# Altium project SINUX_F1.PrjPcb
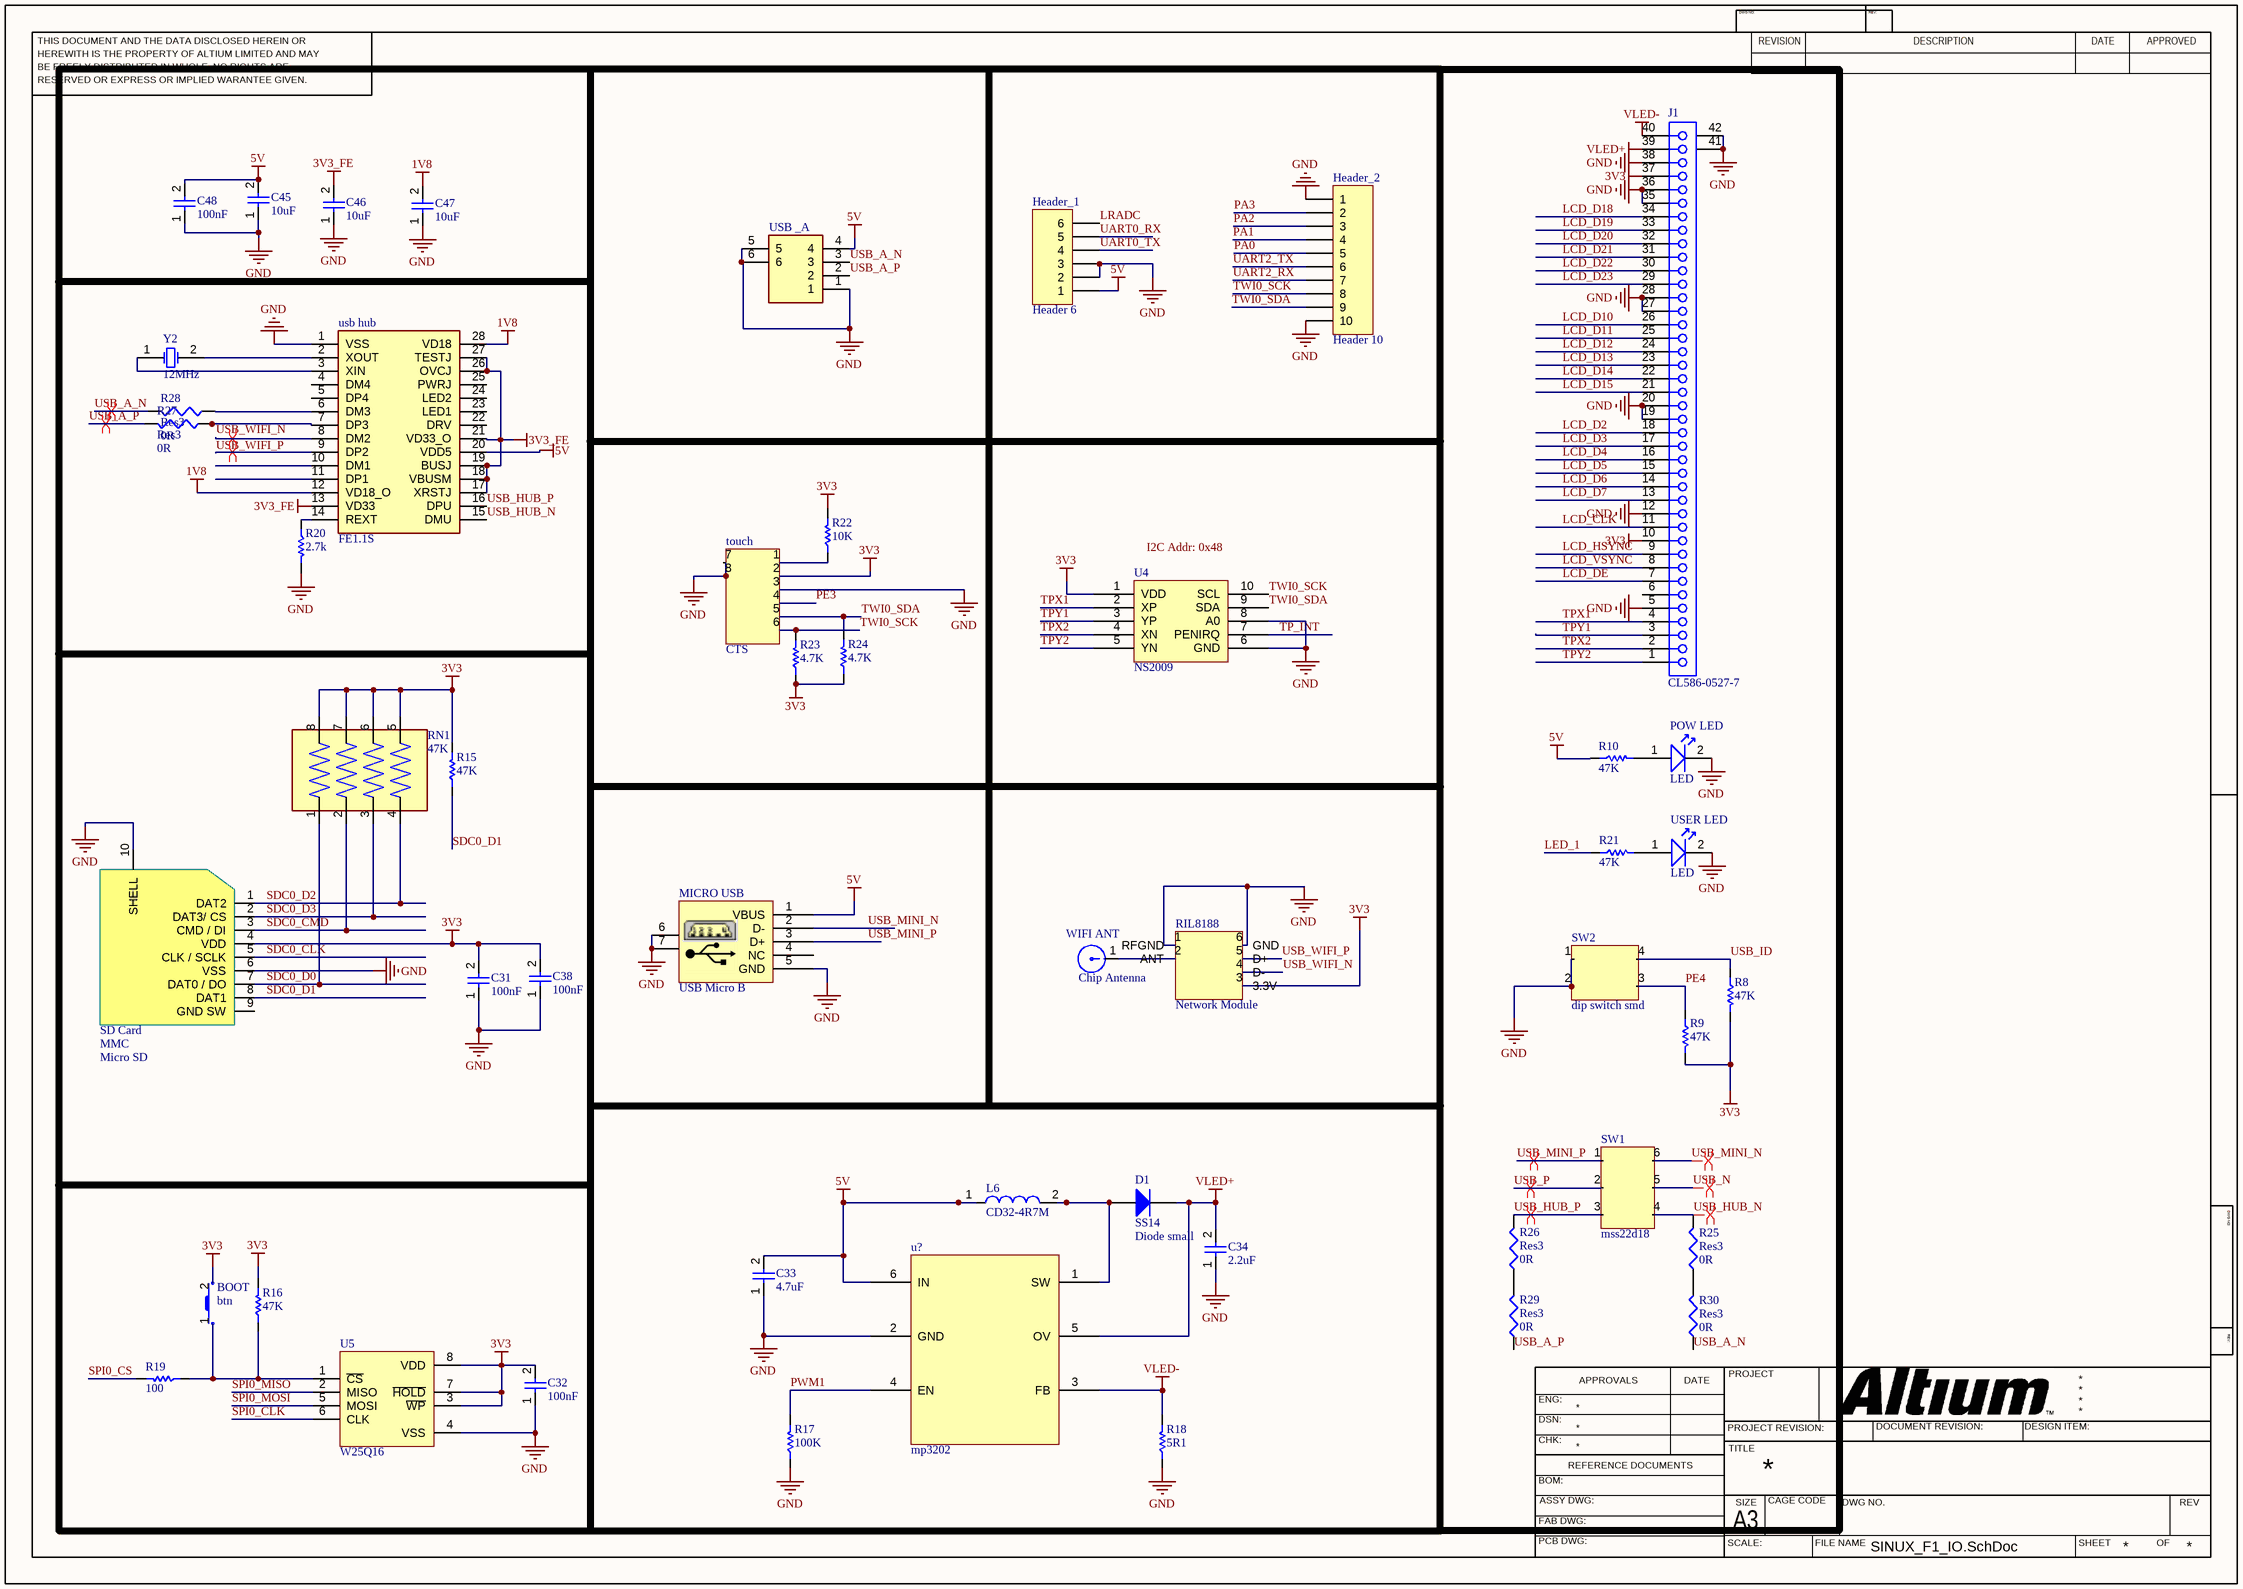
[diagram p0: SINUX_F1_IO.SchDoc]
3 sheets, 107 parts. Net scope: global (net labels, ports and power ports of the same name join across sheets).
Board file: SINUX_F1.PcbDoc
Sheets:
  SINUX_F1_IO.SchDoc
  SINUX_F1_MAIN.SchDoc
  SINUX_F1_POWER.SchDoc

## Sheet SINUX_F1_IO.SchDoc
size 420 x 297 mm

### Parts
BOOT  btn  [btn]
C31  100nF  [SMD 0805]
C32  100nF  [SMD 0805]
C33  4.7uF  [SMD 0805]
C34  2.2uF  [SMD 0805]
C38  100nF  [SMD 0805]
C45  10uF  [SMD 0805]
C46  10uF  [SMD 0805]
C47  10uF  [SMD 0805]
C48  100nF  [SMD 0805]
D1  SS14  [Diode small SMD]
Header_1  Header 6  [HDR1X6]
Header_2  Header 10  [HDR1X10]
J1  CL586-0527-7  [FH12-40S-0.5SH]
L6  CD32-4R7M  [CD324R7M]
MICRO_USB  USB Micro B  [USB mini]
POW_LED  LED  [0805 LED]
R8  47K  [0805_1/8W]
R9  47K  [0805_1/8W]
R10  47K  [0805_1/8W]
R15  47K  [0805_1/8W]
R16  47K  [0805_1/8W]
R17  100K  [0805_1/8W]
R18  5R1  [0805_1/8W]
R19  100  [0805_1/8W]
R20  2.7k  [0805_1/8W]
R21  47K  [0805_1/8W]
R22  10K  [0805_1/8W]
R23  4.7K  [0805_1/8W]
R24  4.7K  [0805_1/8W]
R25  Res3  value 0R  [J1-0603]
R26  Res3  value 0R  [J1-0603]
R27  Res3  value 0R  [J1-0603]
R28  Res3  value 0R  [J1-0603]
R29  Res3  value 0R  [J1-0603]
R30  Res3  value 0R  [J1-0603]
RIL8188  Network Module  [ril8188]
RN1  47K  [RESCAF80P320X160X60-8N]
SD_Card  MMC  [MICRO SD]
SW1  mss22d18  [MSS22D18]
SW2  dip switch smd  [DIP SWITCH SMD]
touch  CTS  [TS]
U4  NS2009  [SOP50P490X110-11N]
U5  W25Q16  [SOIC 8-Lead  (5.08mm)]
u?  mp3202  [SOP95P275X110-6N]
USB__A  (no value)  [614104150121]
usb_hub  FE1.1S  [SOP64P600X175-28N]
USER_LED  LED  [0805 LED]
WIFI_ANT  Chip Antenna  [2.4GHz Antenna]
Y2  12MHz  [XTAL  SMD]

### Nets
1V8: C47.2 usb_hub.12(VD18_O) usb_hub.28(VD18)
3V3: BOOT.2 C31.2 C32.2 C38.2 J1.10 J1.37 R8.2 R9.2 R15.2 R16.2 R22.2 R23.1 R24.1 RIL8188.3(3.3V) RN1.5 RN1.6 RN1.7 RN1.8 SD_Card.4(VDD) touch.2 U4.1(VDD) U5.3(~{WP}) U5.7(~{HOLD}) U5.8(VDD)
3V3_FE: C46.2 usb_hub.13(VD33) usb_hub.17(XRSTJ) usb_hub.18(VBUSM) usb_hub.19(BUSJ) usb_hub.21(VD33_O) usb_hub.26(OVCJ) usb_hub.27(TESTJ)
5V: C33.2 C45.2 C48.2 Header_1.1 L6.1 MICRO_USB.1(VBUS) R10.1 u?.6(IN) USB__A.4 usb_hub.20(VDD5)
GND: C31.1 C32.1 C33.1 C34.1 C38.1 C45.1 C46.1 C47.1 C48.1 Header_1.2 Header_1.3 Header_2.1 Header_2.10 J1.5 J1.12 J1.19 J1.20 J1.27 J1.28 J1.35 J1.36 J1.38 J1.41(MH1) J1.42(MH2) MICRO_USB.5(GND) MICRO_USB.6 MICRO_USB.7 POW_LED.2 R17.1 R18.1 R20.2 RIL8188.1(RFGND) RIL8188.6(GND) SD_Card.6(VSS) SD_Card.10(SHELL) SW2.1 SW2.2 touch.3 touch.7 touch.8 U4.6(GND) U4.8(A0) U5.4(VSS) u?.2(GND) USB__A.1 USB__A.5 USB__A.6 usb_hub.1(VSS) USER_LED.2
VLED+: C34.2 D1.2(K) J1.39 u?.5(OV)
VLED-: J1.40 R18.2 u?.3(FB)
LCD_CLK: J1.11
LCD_D2: J1.18
LCD_D3: J1.17
LCD_D4: J1.16
LCD_D5: J1.15
LCD_D6: J1.14
LCD_D7: J1.13
LCD_D10: J1.26
LCD_D11: J1.25
LCD_D12: J1.24
LCD_D13: J1.23
LCD_D14: J1.22
LCD_D15: J1.21
LCD_D18: J1.34
LCD_D19: J1.33
LCD_D20: J1.32
LCD_D21: J1.31
LCD_D22: J1.30
LCD_D23: J1.29
LCD_DE: J1.7
LCD_HSYNC: J1.9
LCD_VSYNC: J1.8
LED_1: R21.1
LRADC: Header_1.6
PA0: Header_2.5
PA1: Header_2.4
PA2: Header_2.3
PA3: Header_2.2
PE3: touch.4  [project net CSI_D0]
PE4: R9.1 SW2.3  [project net CSI_D1]
PWM1: R17.2 u?.4(EN)  [project net CSI_D3]
SDC0_CLK: SD_Card.5(CLK_/_SCLK)
SDC0_CMD: RN1.2 SD_Card.3(CMD_/_DI)
SDC0_D0: RN1.1 SD_Card.7(DAT0_/_DO)
SDC0_D1: R15.1 SD_Card.8(DAT1)
SDC0_D2: RN1.4 SD_Card.1(DAT2)
SDC0_D3: RN1.3 SD_Card.2(DAT3/_CS)
SPI0_CLK: U5.6(CLK)
SPI0_CS: R19.2
SPI0_MISO: U5.2(MISO)
SPI0_MOSI: U5.5(MOSI)
TP_INT: U4.7(PENIRQ)
TPX1: J1.4 U4.2(XP)
TPX2: J1.2 U4.4(XN)
TPY1: J1.3 U4.3(YP)
TPY2: J1.1 U4.5(YN)
TWI0_SCK: Header_2.8 R23.2 touch.6 U4.10(SCL)  [project net CLK_OUT]
TWI0_SDA: Header_2.9 R24.2 touch.5 U4.9(SDA)  [project net DA_MCLK]
UART0_RX: Header_1.5  [project net CSI_HSYNC]
UART0_TX: Header_1.4  [project net CSI_VSYNC]
UART2_RX: Header_2.7  [project net CSI_D5]
UART2_TX: Header_2.6  [project net CSI_D4]
USB_A_N: R28.2 R30.1 USB__A.3
USB_A_P: R27.2 R29.1 USB__A.2
USB_HUB_N: R25.2 SW1.4 usb_hub.15(DMU)
USB_HUB_P: R26.2 SW1.3 usb_hub.16(DPU)
USB_ID: R8.1 SW2.4
USB_MINI_N: MICRO_USB.2(D-) SW1.6
USB_MINI_P: MICRO_USB.3(D+) SW1.1
USB_N: SW1.5
USB_P: SW1.2
USB_WIFI_N: RIL8188.4(D-) usb_hub.8(DM2)
USB_WIFI_P: RIL8188.5(D+) usb_hub.9(DP2)
NetBOOT_1: BOOT.1 R16.1 R19.1 U5.1(~{CS})
NetD1_1: D1.1(A) L6.2 u?.1(SW)
NetPOW_LED_1: POW_LED.1 R10.2
NetR20_1: R20.1 usb_hub.14(REXT)
NetR21_2: R21.2 USER_LED.1
NetR22_1: R22.1 touch.1
NetR25_1: R25.1 R30.2
NetR26_1: R26.1 R29.2
NetR27_1: R27.1 usb_hub.7(DP3)
NetR28_1: R28.1 usb_hub.6(DM3)
NetRIL8188_2: RIL8188.2(ANT) WIFI_ANT.1
Netusb_hub_2: usb_hub.2(XOUT) Y2.2(OSC2)
Netusb_hub_3: usb_hub.3(XIN) Y2.1(OSC1)

Not connected (* = marked no-connect by the designer): J1 6; MICRO_USB 4(NC); SD_Card 9(GND_SW); usb_hub 4(DM4) 5(DP4) 10(DM1) 11(DP1) 22(DRV) 23(LED1) 24(LED2) 25(PWRJ)

### Layout directives
differential pair: USB_A_N, USB_A_P, USB_HUB_N, USB_HUB_P, USB_MINI_N, USB_MINI_P, USB_N, USB_P, USB_WIFI_N, USB_WIFI_P

### Notes on the sheet
- Labels drawn without touching a wire or pin: I2C Addr: 0x48
- THIS DOCUMENT AND THE DATA DISCLOSED HEREIN OR
- HEREWITH IS THE PROPERTY OF ALTIUM LIMITED AND MAY
- DWG NO:
- REVISION
- REV:
- DESCRIPTION
- DATE
- APPROVED
- BE FREELY DISTRIBUTED IN WHOLE. NO RIGHTS ARE
- RESERVED OR EXPRESS OR IMPLIED WARANTEE GIVEN.
- ENG:
- APPROVALS
- PROJECT
- DSN:
- CHK:
- REFERENCE DOCUMENTS
- PROJECT REVISION:
- TITLE
- DOCUMENT REVISION:
- DESIGN ITEM:
- BOM:
- FAB DWG:
- PCB DWG:
- ASSY DWG:
- SCALE:
- A3
- SIZE
- CAGE CODE
- FILE NAME
- DWG NO.
- SHEET
- OF
- REV
- (in symbol Diode) Diode small
- (in symbol MMC) Micro SD

### Library data of the parts
C31 C38 C45-C47 = CAP NON
C32-C34 C48 = CAP NON: Capacitor; Manufacturer Part Number 1: 10uF; Supplier 1: SMD-0805
D1 = Diode
Header_1 = Header 6: Header, 6-Pin; LatestRevisionDate: 17-Jul-2002; LatestRevisionNote: Re-released for DXP Platform.; Publisher: Altium Limited
Header_2 = Header 10: Header, 10-Pin; LatestRevisionDate: 17-Jul-2002; LatestRevisionNote: Re-released for DXP Platform.; Publisher: Altium Limited
J1 = CL586-0527-7: FH12 Series, "Flip-Lock" SMT/ZIF FFC/FPC Connector - 0.5mm Spaced Bottom Contact; Positions: 40; ContactMaterial: Phosphor Bronze; Current: 0.4A; PCB_Layout: Complies with manufacturer's recommendation.; Published: 17-Jul-2002; DatasheetVersion: 13-Nov-2000; PackageVersion: 13-Nov-2000; PackageReference: FH12-40S-0.5SH; Publisher: Altium Limited; PadDimensions: Follow nominal values, Suitable for Wave Soldering, Adjust for Re-flow.; ComponentLink1Description: Manufacturer Link; ComponentLink1URL: http://www.hiroseusa.com/; ComponentLink2Description: Datasheet; ComponentLink2URL: http://www.hirose.co.jp/cataloge_hp/e58605370.pdf
L6 = CD32-4R7M: Inductor; Manufacturer_Name: Shuo Xing; Datasheet Link: http://aitendo3.sakura.ne.jp/aitendo_data/product_img/parts/coil/CD32/CD32.pdf; Height: 2.4mm; Manufacturer_Part_Number: CD32-4R7M
R8-R10 R15-R24 = RESISTOR
R25-R30 = Res3: Resistor; Published: 8-Jun-2000; LatestRevisionDate: 29-May-2009; LatestRevisionNote: IPC-7351 Footprint Added.; PackageReference: J1-0603; Publisher: Altium Limited; PackageDescription: Chip Resistor
RIL8188 = RIL8188
RN1 = CAY16-270J4LF: 27 Ohm Â±5% 62.5mW Power Per Element Isolated Resistor Network/Array Â±200ppm/Â°C 1206 (3216 Metric), Convex, Long Side Terminals; MF: Bourns; Purchase-URL: https://pricing.snapeda.com/search/part/CAY16-270J4LF/?ref=eda; MP: CAY16-270J4LF; Package: 1206 Bourns; Price: None; Availability: Good; SnapEDA_Link: https://www.snapeda.com/parts/CAY16-270J4LF/Bourns/view-part/1118422/?ref=snap; Value: *; Check_prices: https://www.snapeda.com/parts/CAY16-270J4LF/Bourns/view-part/1118422/?ref=eda
U5 = SST25VF032: SERIAL FLASH MEMORY; Manufacturer Part Number 1: W25Q32JV-DTR; Manufacturer 1: Winbond; Supplier 1: 8-Pin SOIC 208-mil
USB__A = 614104150121: Connector; Manufacturer_Name: Wurth Elektronik; Datasheet Link: http://docs-emea.rs-online.com/webdocs/14ff/0900766b814ff8e2.pdf; Manufacturer_Part_Number: 614104150121; Mouser Part Number: 710-614104150121; Mouser Price/Stock: https://www.mouser.co.uk/ProductDetail/Wurth-Elektronik/614104150121?qs=a9WhcLg8qCz3wt21uTqGxw%3D%3D
usb_hub = FE1.1S: Integrated Circuit; Manufacturer_Name: JFD IC; Datasheet Link: https://cdn-shop.adafruit.com/product-files/2991/FE1.1s+Data+Sheet+(Rev.+1.0).pdf; Height: 1.75mm; Manufacturer_Part_Number: FE1.1S
Y2 = XTAL

## Sheet SINUX_F1_MAIN.SchDoc
size A
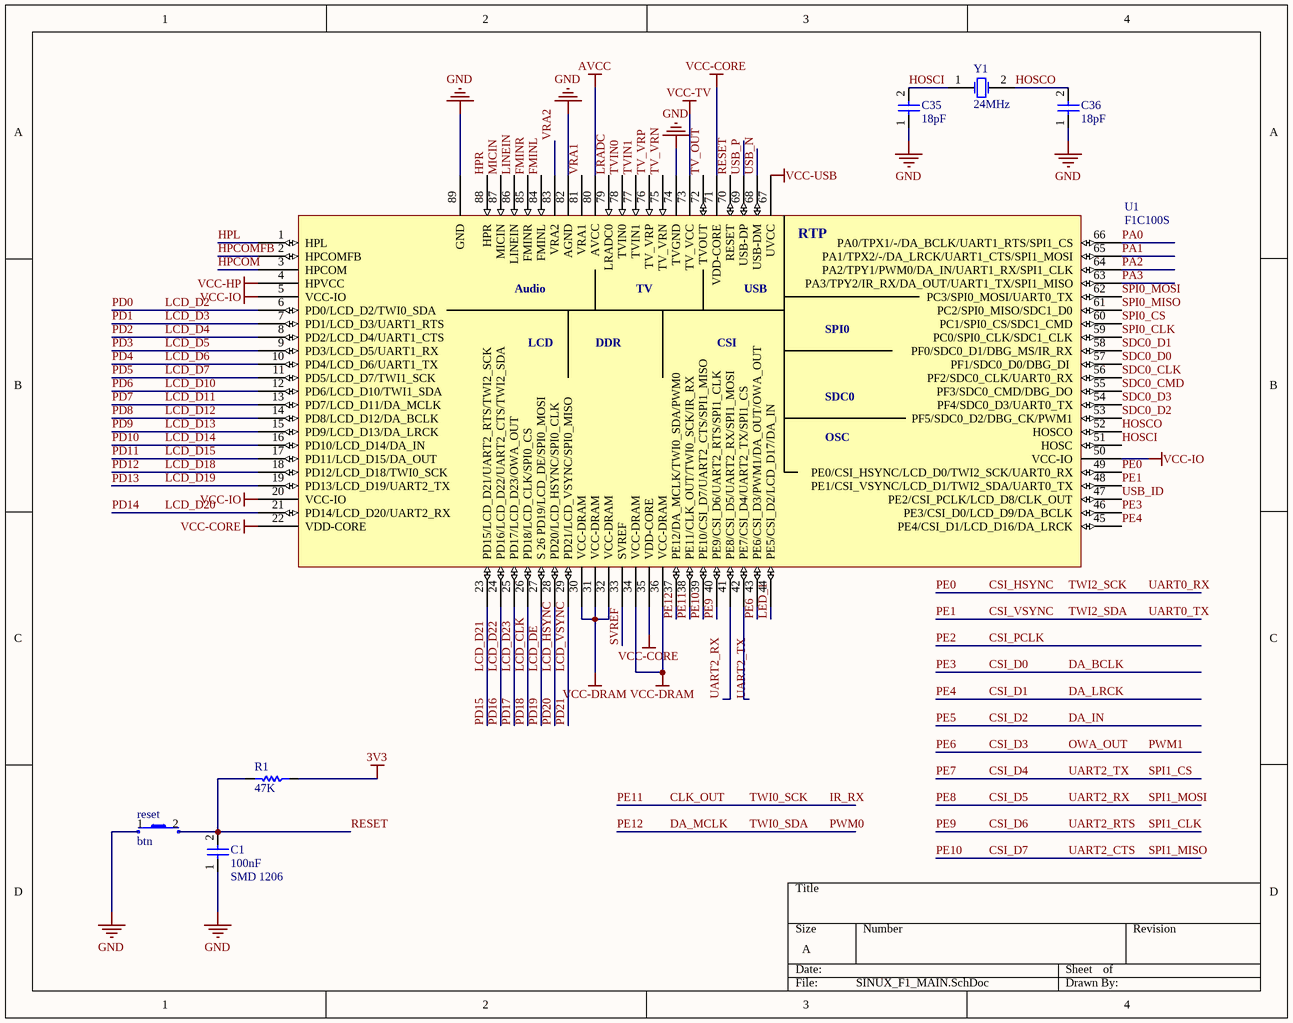
[diagram p1: SINUX_F1_MAIN.SchDoc]

### Parts
C1  100nF  [SMD 0805]
C35  18pF  [SMD 0805]
C36  18pF  [SMD 0805]
R1  47K  [0805_1/8W]
reset  btn  [btn]
U1  F1C100S  [QFN40P1000X1000X90-89N]
Y1  24MHz  [XTAL  SMD]

### Nets
3V3: R1.1 U1.4(HPVCC) U1.5(VCC-IO) U1.20(VCC-IO) U1.50(VCC-IO) U1.67(UVCC) U1.73(TV_VCC)  [also labelled VCC-HP, VCC-IO, VCC-TV, VCC-USB]
AVCC: U1.80(AVCC)  [project net 3V0]
GND: C1.1 C35.1 C36.1 reset.1 U1.74(TVGND) U1.82(AGND) U1.89(GND)
VCC-CORE: U1.22(VDD-CORE) U1.35(VDD-CORE) U1.71(VDD-CORE)  [project net 1V1]
VCC-DRAM: U1.30(VCC-DRAM) U1.31(VCC-DRAM) U1.32(VCC-DRAM) U1.34(VCC-DRAM) U1.36(VCC-DRAM)  [project net 2V5]
CLK_OUT: U1.38(PE11/CLK_OUT/TWI0_SCK/IR_RX)  [also labelled IR_RX, PE11, TWI0_SCK]
CSI_D0: U1.46(PE3/CSI_D0/LCD_D9/DA_BCLK)  [also labelled DA_BCLK, PE3]
CSI_D1: U1.45(PE4/CSI_D1/LCD_D16/DA_LRCK)  [also labelled DA_LRCK, PE4]
CSI_D3: U1.43(PE6/CSI_D3/PWM1/DA_OUT/OWA_OUT)  [also labelled OWA_OUT, PE6, PWM1]
CSI_D4: U1.42(PE7/CSI_D4/UART2_TX/SPI1_CS)  [also labelled PE7, SPI1_CS, UART2_TX]
CSI_D5: U1.41(PE8/CSI_D5/UART2_RX/SPI1_MOSI)  [also labelled PE8, SPI1_MOSI, UART2_RX]
CSI_D6: U1.40(PE9/CSI_D6/UART2_RTS/SPI1_CLK)  [also labelled PE9, SPI1_CLK, UART2_RTS]
CSI_D7: U1.39(PE10/CSI_D7/UART2_CTS/SPI1_MISO)  [also labelled PE10, SPI1_MISO, UART2_CTS]
CSI_HSYNC: U1.49(PE0/CSI_HSYNC/LCD_D0/TWI2_SCK/UART0_RX)  [also labelled PE0, TWI2_SCK, UART0_RX]
CSI_VSYNC: U1.48(PE1/CSI_VSYNC/LCD_D1/TWI2_SDA/UART0_TX)  [also labelled PE1, TWI2_SDA, UART0_TX]
DA_MCLK: U1.37(PE12/DA_MCLK/TWI0_SDA/PWM0)  [also labelled PE12, PWM0, TWI0_SDA]
FMINL: U1.84(FMINL)
FMINR: U1.85(FMINR)
HOSCI: C35.2 U1.51(HOSC) Y1.1(OSC1)
HOSCO: C36.2 U1.52(HOSCO) Y1.2(OSC2)
HPCOM: U1.3(HPCOM)
HPCOMFB: U1.2(HPCOMFB)
HPL: U1.1(HPL)
HPR: U1.88(HPR)
LCD_CLK: U1.26(PD18/LCD_CLK/SPI0_CS)  [also labelled PD18]
LCD_D2: U1.6(PD0/LCD_D2/TWI0_SDA)  [also labelled PD0]
LCD_D3: U1.7(PD1/LCD_D3/UART1_RTS)  [also labelled PD1]
LCD_D4: U1.8(PD2/LCD_D4/UART1_CTS)  [also labelled PD2]
LCD_D5: U1.9(PD3/LCD_D5/UART1_RX)  [also labelled PD3]
LCD_D6: U1.10(PD4/LCD_D6/UART1_TX)  [also labelled PD4]
LCD_D7: U1.11(PD5/LCD_D7/TWI1_SCK)  [also labelled PD5]
LCD_D10: U1.12(PD6/LCD_D10/TWI1_SDA)  [also labelled PD6]
LCD_D11: U1.13(PD7/LCD_D11/DA_MCLK)  [also labelled PD7]
LCD_D12: U1.14(PD8/LCD_D12/DA_BCLK)  [also labelled PD8]
LCD_D13: U1.15(PD9/LCD_D13/DA_LRCK)  [also labelled PD9]
LCD_D14: U1.16(PD10/LCD_D14/DA_IN)  [also labelled PD10]
LCD_D15: U1.17(PD11/LCD_D15/DA_OUT)  [also labelled PD11]
LCD_D18: U1.18(PD12/LCD_D18/TWI0_SCK)  [also labelled PD12]
LCD_D19: U1.19(PD13/LCD_D19/UART2_TX)  [also labelled PD13]
LCD_D20: U1.21(PD14/LCD_D20/UART2_RX)  [also labelled PD14]
LCD_D21: U1.23(PD15/LCD_D21/UART2_RTS/TWI2_SCK)  [also labelled PD15]
LCD_D22: U1.24(PD16/LCD_D22/UART2_CTS/TWI2_SDA)  [also labelled PD16]
LCD_D23: U1.25(PD17/LCD_D23/OWA_OUT)  [also labelled PD17]
LCD_DE: U1.27(S_26_PD19/LCD_DE/SPI0_MOSI)  [also labelled PD19]
LCD_HSYNC: U1.28(PD20/LCD_HSYNC/SPI0_CLK)  [also labelled PD20]
LCD_VSYNC: U1.29(PD21/LCD_VSYNC/SPI0_MISO)  [also labelled PD21]
LED_1: U1.44(PE5/CSI_D2/LCD_D17/DA_IN)
LINEIN: U1.86(LINEIN)
LRADC: U1.79(LRADC0)
MICIN: U1.87(MICIN)
PA0: U1.66(PA0/TPX1/-/DA_BCLK/UART1_RTS/SPI1_CS)
PA1: U1.65(PA1/TPX2/-/DA_LRCK/UART1_CTS/SPI1_MOSI)
PA2: U1.64(PA2/TPY1/PWM0/DA_IN/UART1_RX/SPI1_CLK)
PA3: U1.63(PA3/TPY2/IR_RX/DA_OUT/UART1_TX/SPI1_MISO)
RESET: C1.2 R1.2 reset.2 U1.70(RESET)
SDC0_CLK: U1.56(PF2/SDC0_CLK/UART0_RX)
SDC0_CMD: U1.55(PF3/SDC0_CMD/DBG_DO)
SDC0_D0: U1.57(PF1/SDC0_D0/DBG_DI)
SDC0_D1: U1.58(PF0/SDC0_D1/DBG_MS/IR_RX)
SDC0_D2: U1.53(PF5/SDC0_D2/DBG_CK/PWM1)
SDC0_D3: U1.54(PF4/SDC0_D3/UART0_TX)
SPI0_CLK: U1.59(PC0/SPI0_CLK/SDC1_CLK)
SPI0_CS: U1.60(PC1/SPI0_CS/SDC1_CMD)
SPI0_MISO: U1.61(PC2/SPI0_MISO/SDC1_D0)
SPI0_MOSI: U1.62(PC3/SPI0_MOSI/UART0_TX)
SVREF: U1.33(SVREF)
TV_OUT: U1.72(TVOUT)
TV_VRN: U1.75(TV_VRN)
TV_VRP: U1.76(TV_VRP)
TVIN0: U1.78(TVIN0)
TVIN1: U1.77(TVIN1)
USB_ID: U1.47(PE2/CSI_PCLK/LCD_D8/CLK_OUT)
USB_N: U1.68(USB-DM)
USB_P: U1.69(USB-DP)
VRA1: U1.81(VRA1)
VRA2: U1.83(VRA2)

### Notes on the sheet
- (in symbol CAP NON) SMD 1206
- (in symbol F1C100S) RTP; Audio; TV; USB; SPI0; LCD; DDR; CSI; SDC0; OSC

### Library data of the parts
C1 = CAP NON
C35 C36 = CAP NON: as C32 on sheet SINUX_F1_IO; Supplier 1: SMD-0805
R1 = RESISTOR
Y1 = XTAL

## Sheet SINUX_F1_POWER.SchDoc
size A4
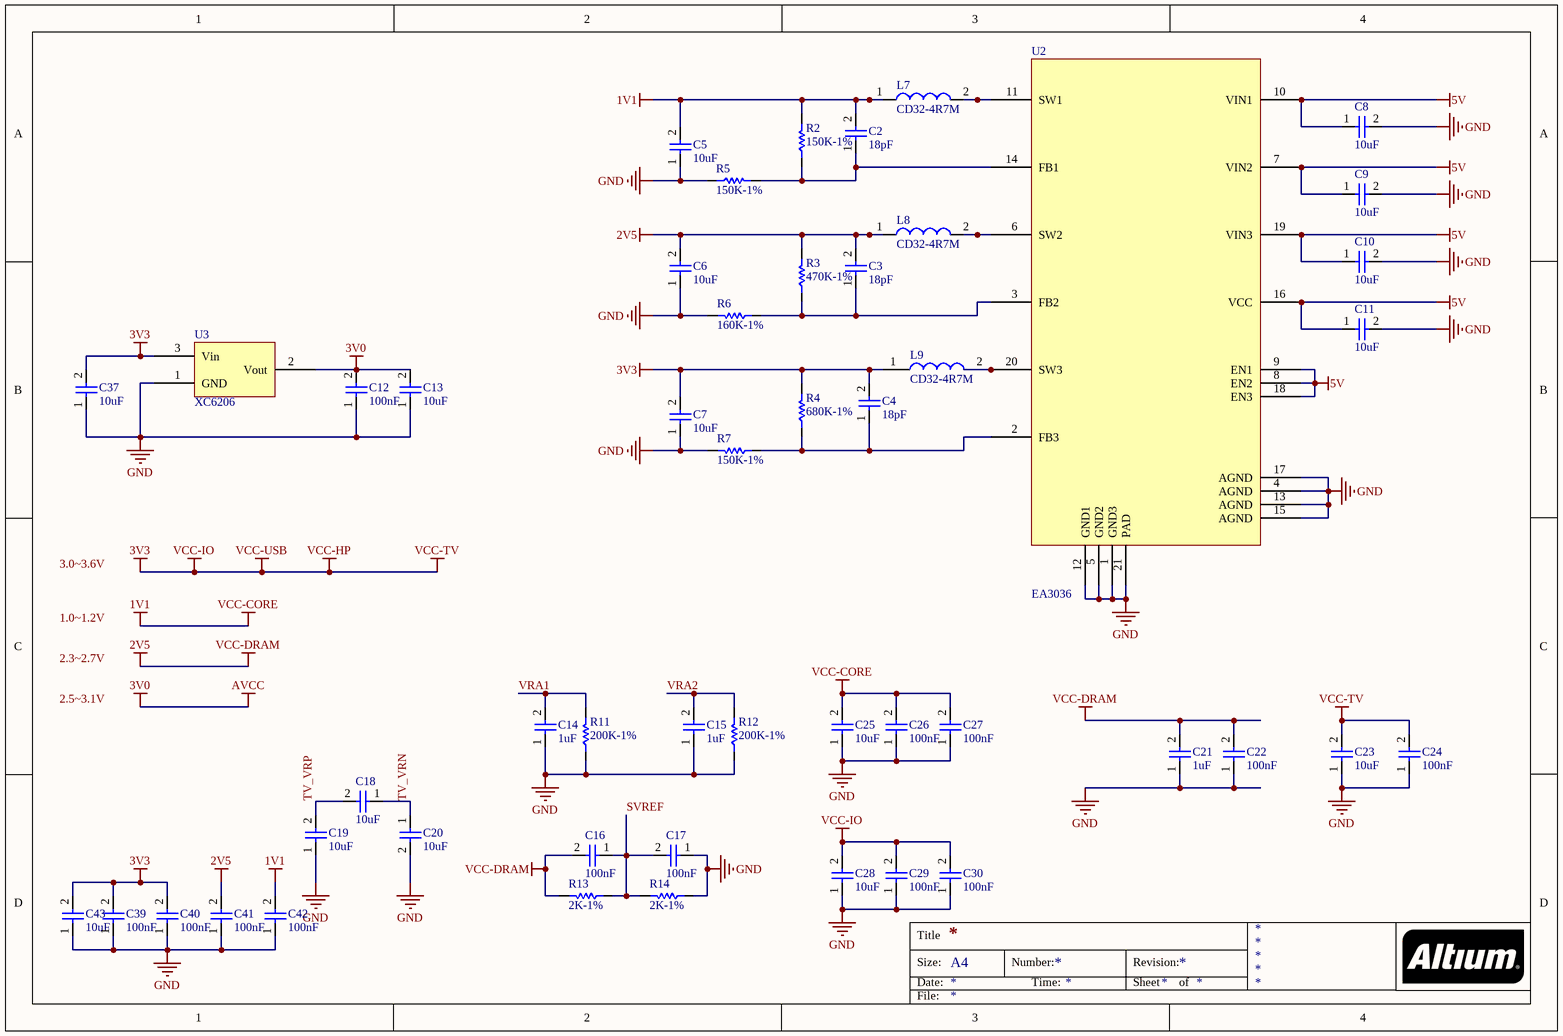
[diagram p2: SINUX_F1_POWER.SchDoc]

### Parts
C2  18pF  [SMD 0805]
C3  18pF  [SMD 0805]
C4  18pF  [SMD 0805]
C5  10uF  [SMD 0805]
C6  10uF  [SMD 0805]
C7  10uF  [SMD 0805]
C8  10uF  [SMD 0805]
C9  10uF  [SMD 0805]
C10  10uF  [SMD 0805]
C11  10uF  [SMD 0805]
C12  100nF  [SMD 0805]
C13  10uF  [SMD 0805]
C14  1uF  [SMD 0805]
C15  1uF  [SMD 0805]
C16  100nF  [SMD 0805]
C17  100nF  [SMD 0805]
C18  10uF  [SMD 0805]
C19  10uF  [SMD 0805]
C20  10uF  [SMD 0805]
C21  1uF  [SMD 0805]
C22  100nF  [SMD 0805]
C23  10uF  [SMD 0805]
C24  100nF  [SMD 0805]
C25  10uF  [SMD 0805]
C26  100nF  [SMD 0805]
C27  100nF  [SMD 0805]
C28  10uF  [SMD 0805]
C29  100nF  [SMD 0805]
C30  100nF  [SMD 0805]
C37  10uF  [SMD 0805]
C39  100nF  [SMD 0805]
C40  100nF  [SMD 0805]
C41  100nF  [SMD 0805]
C42  100nF  [SMD 0805]
C43  10uF  [SMD 0805]
L7  CD32-4R7M  [CD324R7M]
L8  CD32-4R7M  [CD324R7M]
L9  CD32-4R7M  [CD324R7M]
R2  150K-1%  [0805_1/8W]
R3  470K-1%  [0805_1/8W]
R4  680K-1%  [0805_1/8W]
R5  150K-1%  [0805_1/8W]
R6  160K-1%  [0805_1/8W]
R7  150K-1%  [0805_1/8W]
R11  200K-1%  [0805_1/8W]
R12  200K-1%  [0805_1/8W]
R13  2K-1%  [0805_1/8W]
R14  2K-1%  [0805_1/8W]
U2  EA3036  [QFN40P300X300X80-21N]
U3  XC6206  [SOT95P280X130-3N]

### Nets
1V1: C2.2 C5.2 C25.2 C26.2 C27.2 C42.2 L7.1 R2.2  [also labelled VCC-CORE]
2V5: C3.2 C6.2 C16.2 C21.2 C22.2 C41.2 L8.1 R3.2 R13.2  [also labelled VCC-DRAM]
3V0: C12.2 C13.2 U3.2(Vout)  [also labelled AVCC]
3V3: C4.2 C7.2 C23.2 C24.2 C28.2 C29.2 C30.2 C37.2 C39.2 C40.2 C43.2 L9.1 R4.2 U3.3(Vin)  [also labelled VCC-HP, VCC-IO, VCC-TV, VCC-USB]
5V: C8.1 C9.1 C10.1 C11.1 U2.7(VIN2) U2.8(EN2) U2.9(EN1) U2.10(VIN1) U2.16(VCC) U2.18(EN3) U2.19(VIN3)
GND: C5.1 C6.1 C7.1 C8.2 C9.2 C10.2 C11.2 C12.1 C13.1 C14.1 C15.1 C17.1 C19.1 C20.2 C21.1 C22.1 C23.1 C24.1 C25.1 C26.1 C27.1 C28.1 C29.1 C30.1 C37.1 C39.1 C40.1 C41.1 C42.1 C43.1 R5.1 R6.2 R7.2 R11.1 R12.1 R14.1 U2.1(GND3) U2.4(AGND) U2.5(GND2) U2.12(GND1) U2.13(AGND) U2.15(AGND) U2.17(AGND) U2.21(PAD) U3.1(GND)
SVREF: C16.1 C17.2 R13.1 R14.2
TV_VRN: C18.1 C20.1
TV_VRP: C18.2 C19.2
VRA1: C14.2 R11.2
VRA2: C15.2 R12.2
NetC2_1: C2.1 R2.1 R5.2 U2.14(FB1)
NetC3_1: C3.1 R3.1 R6.1 U2.3(FB2)
NetC4_1: C4.1 R4.1 R7.1 U2.2(FB3)
NetL7_2: L7.2 U2.11(SW1)
NetL8_2: L8.2 U2.6(SW2)
NetL9_2: L9.2 U2.20(SW3)

### Notes on the sheet
- Labels drawn without touching a wire or pin: 1.0~1.2V, 2.3~2.7V, 2.5~3.1V, 3.0~3.6V
- Title
- Size:
- Date:
- A4
- Number:
- Time:
- Revision:
- Sheet
- of
- File:

### Library data of the parts
C2-C30 C37 C39-C43 = CAP NON
L7-L9 = CD32-4R7M: Inductor; Manufacturer_Name: Shuo Xing; Datasheet Link: http://aitendo3.sakura.ne.jp/aitendo_data/product_img/parts/coil/CD32/CD32.pdf; Height: 2.4mm; Manufacturer_Part_Number: CD32-4R7M
R2-R7 R11-R14 = RESISTOR

## Nets that join several sheets
1V1: SINUX_F1_MAIN (U1.22 U1.35 U1.71), SINUX_F1_POWER (8 pins)
2V5: SINUX_F1_MAIN (5 pins), SINUX_F1_POWER (9 pins)
3V0: SINUX_F1_MAIN (U1.80), SINUX_F1_POWER (C12.2 C13.2 U3.2)
3V3: SINUX_F1_IO (24 pins), SINUX_F1_MAIN (7 pins), SINUX_F1_POWER (14 pins)
5V: SINUX_F1_IO (10 pins), SINUX_F1_POWER (11 pins)
GND: SINUX_F1_IO (49 pins), SINUX_F1_MAIN (7 pins), SINUX_F1_POWER (45 pins)
CLK_OUT: SINUX_F1_IO (Header_2.8 R23.2 touch.6 U4.10), SINUX_F1_MAIN (U1.38)
CSI_D0: SINUX_F1_IO (touch.4), SINUX_F1_MAIN (U1.46)
CSI_D1: SINUX_F1_IO (R9.1 SW2.3), SINUX_F1_MAIN (U1.45)
CSI_D3: SINUX_F1_IO (R17.2 u?.4), SINUX_F1_MAIN (U1.43)
CSI_D4: SINUX_F1_IO (Header_2.6), SINUX_F1_MAIN (U1.42)
CSI_D5: SINUX_F1_IO (Header_2.7), SINUX_F1_MAIN (U1.41)
CSI_HSYNC: SINUX_F1_IO (Header_1.5), SINUX_F1_MAIN (U1.49)
CSI_VSYNC: SINUX_F1_IO (Header_1.4), SINUX_F1_MAIN (U1.48)
DA_MCLK: SINUX_F1_IO (Header_2.9 R24.2 touch.5 U4.9), SINUX_F1_MAIN (U1.37)
LCD_CLK: SINUX_F1_IO (J1.11), SINUX_F1_MAIN (U1.26)
LCD_D2: SINUX_F1_IO (J1.18), SINUX_F1_MAIN (U1.6)
LCD_D3: SINUX_F1_IO (J1.17), SINUX_F1_MAIN (U1.7)
LCD_D4: SINUX_F1_IO (J1.16), SINUX_F1_MAIN (U1.8)
LCD_D5: SINUX_F1_IO (J1.15), SINUX_F1_MAIN (U1.9)
LCD_D6: SINUX_F1_IO (J1.14), SINUX_F1_MAIN (U1.10)
LCD_D7: SINUX_F1_IO (J1.13), SINUX_F1_MAIN (U1.11)
LCD_D10: SINUX_F1_IO (J1.26), SINUX_F1_MAIN (U1.12)
LCD_D11: SINUX_F1_IO (J1.25), SINUX_F1_MAIN (U1.13)
LCD_D12: SINUX_F1_IO (J1.24), SINUX_F1_MAIN (U1.14)
LCD_D13: SINUX_F1_IO (J1.23), SINUX_F1_MAIN (U1.15)
LCD_D14: SINUX_F1_IO (J1.22), SINUX_F1_MAIN (U1.16)
LCD_D15: SINUX_F1_IO (J1.21), SINUX_F1_MAIN (U1.17)
LCD_D18: SINUX_F1_IO (J1.34), SINUX_F1_MAIN (U1.18)
LCD_D19: SINUX_F1_IO (J1.33), SINUX_F1_MAIN (U1.19)
LCD_D20: SINUX_F1_IO (J1.32), SINUX_F1_MAIN (U1.21)
LCD_D21: SINUX_F1_IO (J1.31), SINUX_F1_MAIN (U1.23)
LCD_D22: SINUX_F1_IO (J1.30), SINUX_F1_MAIN (U1.24)
LCD_D23: SINUX_F1_IO (J1.29), SINUX_F1_MAIN (U1.25)
LCD_DE: SINUX_F1_IO (J1.7), SINUX_F1_MAIN (U1.27)
LCD_HSYNC: SINUX_F1_IO (J1.9), SINUX_F1_MAIN (U1.28)
LCD_VSYNC: SINUX_F1_IO (J1.8), SINUX_F1_MAIN (U1.29)
LED_1: SINUX_F1_IO (R21.1), SINUX_F1_MAIN (U1.44)
LRADC: SINUX_F1_IO (Header_1.6), SINUX_F1_MAIN (U1.79)
PA0: SINUX_F1_IO (Header_2.5), SINUX_F1_MAIN (U1.66)
PA1: SINUX_F1_IO (Header_2.4), SINUX_F1_MAIN (U1.65)
PA2: SINUX_F1_IO (Header_2.3), SINUX_F1_MAIN (U1.64)
PA3: SINUX_F1_IO (Header_2.2), SINUX_F1_MAIN (U1.63)
SDC0_CLK: SINUX_F1_IO (SD_Card.5), SINUX_F1_MAIN (U1.56)
SDC0_CMD: SINUX_F1_IO (RN1.2 SD_Card.3), SINUX_F1_MAIN (U1.55)
SDC0_D0: SINUX_F1_IO (RN1.1 SD_Card.7), SINUX_F1_MAIN (U1.57)
SDC0_D1: SINUX_F1_IO (R15.1 SD_Card.8), SINUX_F1_MAIN (U1.58)
SDC0_D2: SINUX_F1_IO (RN1.4 SD_Card.1), SINUX_F1_MAIN (U1.53)
SDC0_D3: SINUX_F1_IO (RN1.3 SD_Card.2), SINUX_F1_MAIN (U1.54)
SPI0_CLK: SINUX_F1_IO (U5.6), SINUX_F1_MAIN (U1.59)
SPI0_CS: SINUX_F1_IO (R19.2), SINUX_F1_MAIN (U1.60)
SPI0_MISO: SINUX_F1_IO (U5.2), SINUX_F1_MAIN (U1.61)
SPI0_MOSI: SINUX_F1_IO (U5.5), SINUX_F1_MAIN (U1.62)
SVREF: SINUX_F1_MAIN (U1.33), SINUX_F1_POWER (C16.1 C17.2 R13.1 R14.2)
TV_VRN: SINUX_F1_MAIN (U1.75), SINUX_F1_POWER (C18.1 C20.1)
TV_VRP: SINUX_F1_MAIN (U1.76), SINUX_F1_POWER (C18.2 C19.2)
USB_ID: SINUX_F1_IO (R8.1 SW2.4), SINUX_F1_MAIN (U1.47)
USB_N: SINUX_F1_IO (SW1.5), SINUX_F1_MAIN (U1.68)
USB_P: SINUX_F1_IO (SW1.2), SINUX_F1_MAIN (U1.69)
VRA1: SINUX_F1_MAIN (U1.81), SINUX_F1_POWER (C14.2 R11.2)
VRA2: SINUX_F1_MAIN (U1.83), SINUX_F1_POWER (C15.2 R12.2)